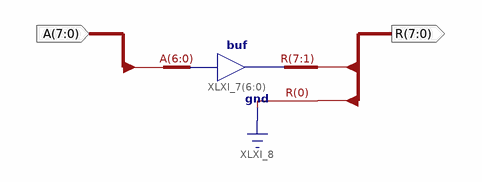
[diagram p0: schematic sheet 1]
// Xilinx ISE schematic ShiftLeft.sch (spartan6) as structural Verilog: 1 symbols, 2 ports
module ShiftLeft (
  input  [7:0] A,
  output [7:0] R
);

  assign R[7:1] = A[6:0];  // buf XLXI_7[6..0], 7 bits wide

  assign R[0] = 1'b0;
endmodule
